# Altium schematic sheet STB_SensorBoard.SchDoc: STB Sensor Board
size A3; Author: flmoll / gruprecht; DrawnBy: flmoll; Organization: PBL; Revision: A; SheetNumber: 1; SheetTotal: 8
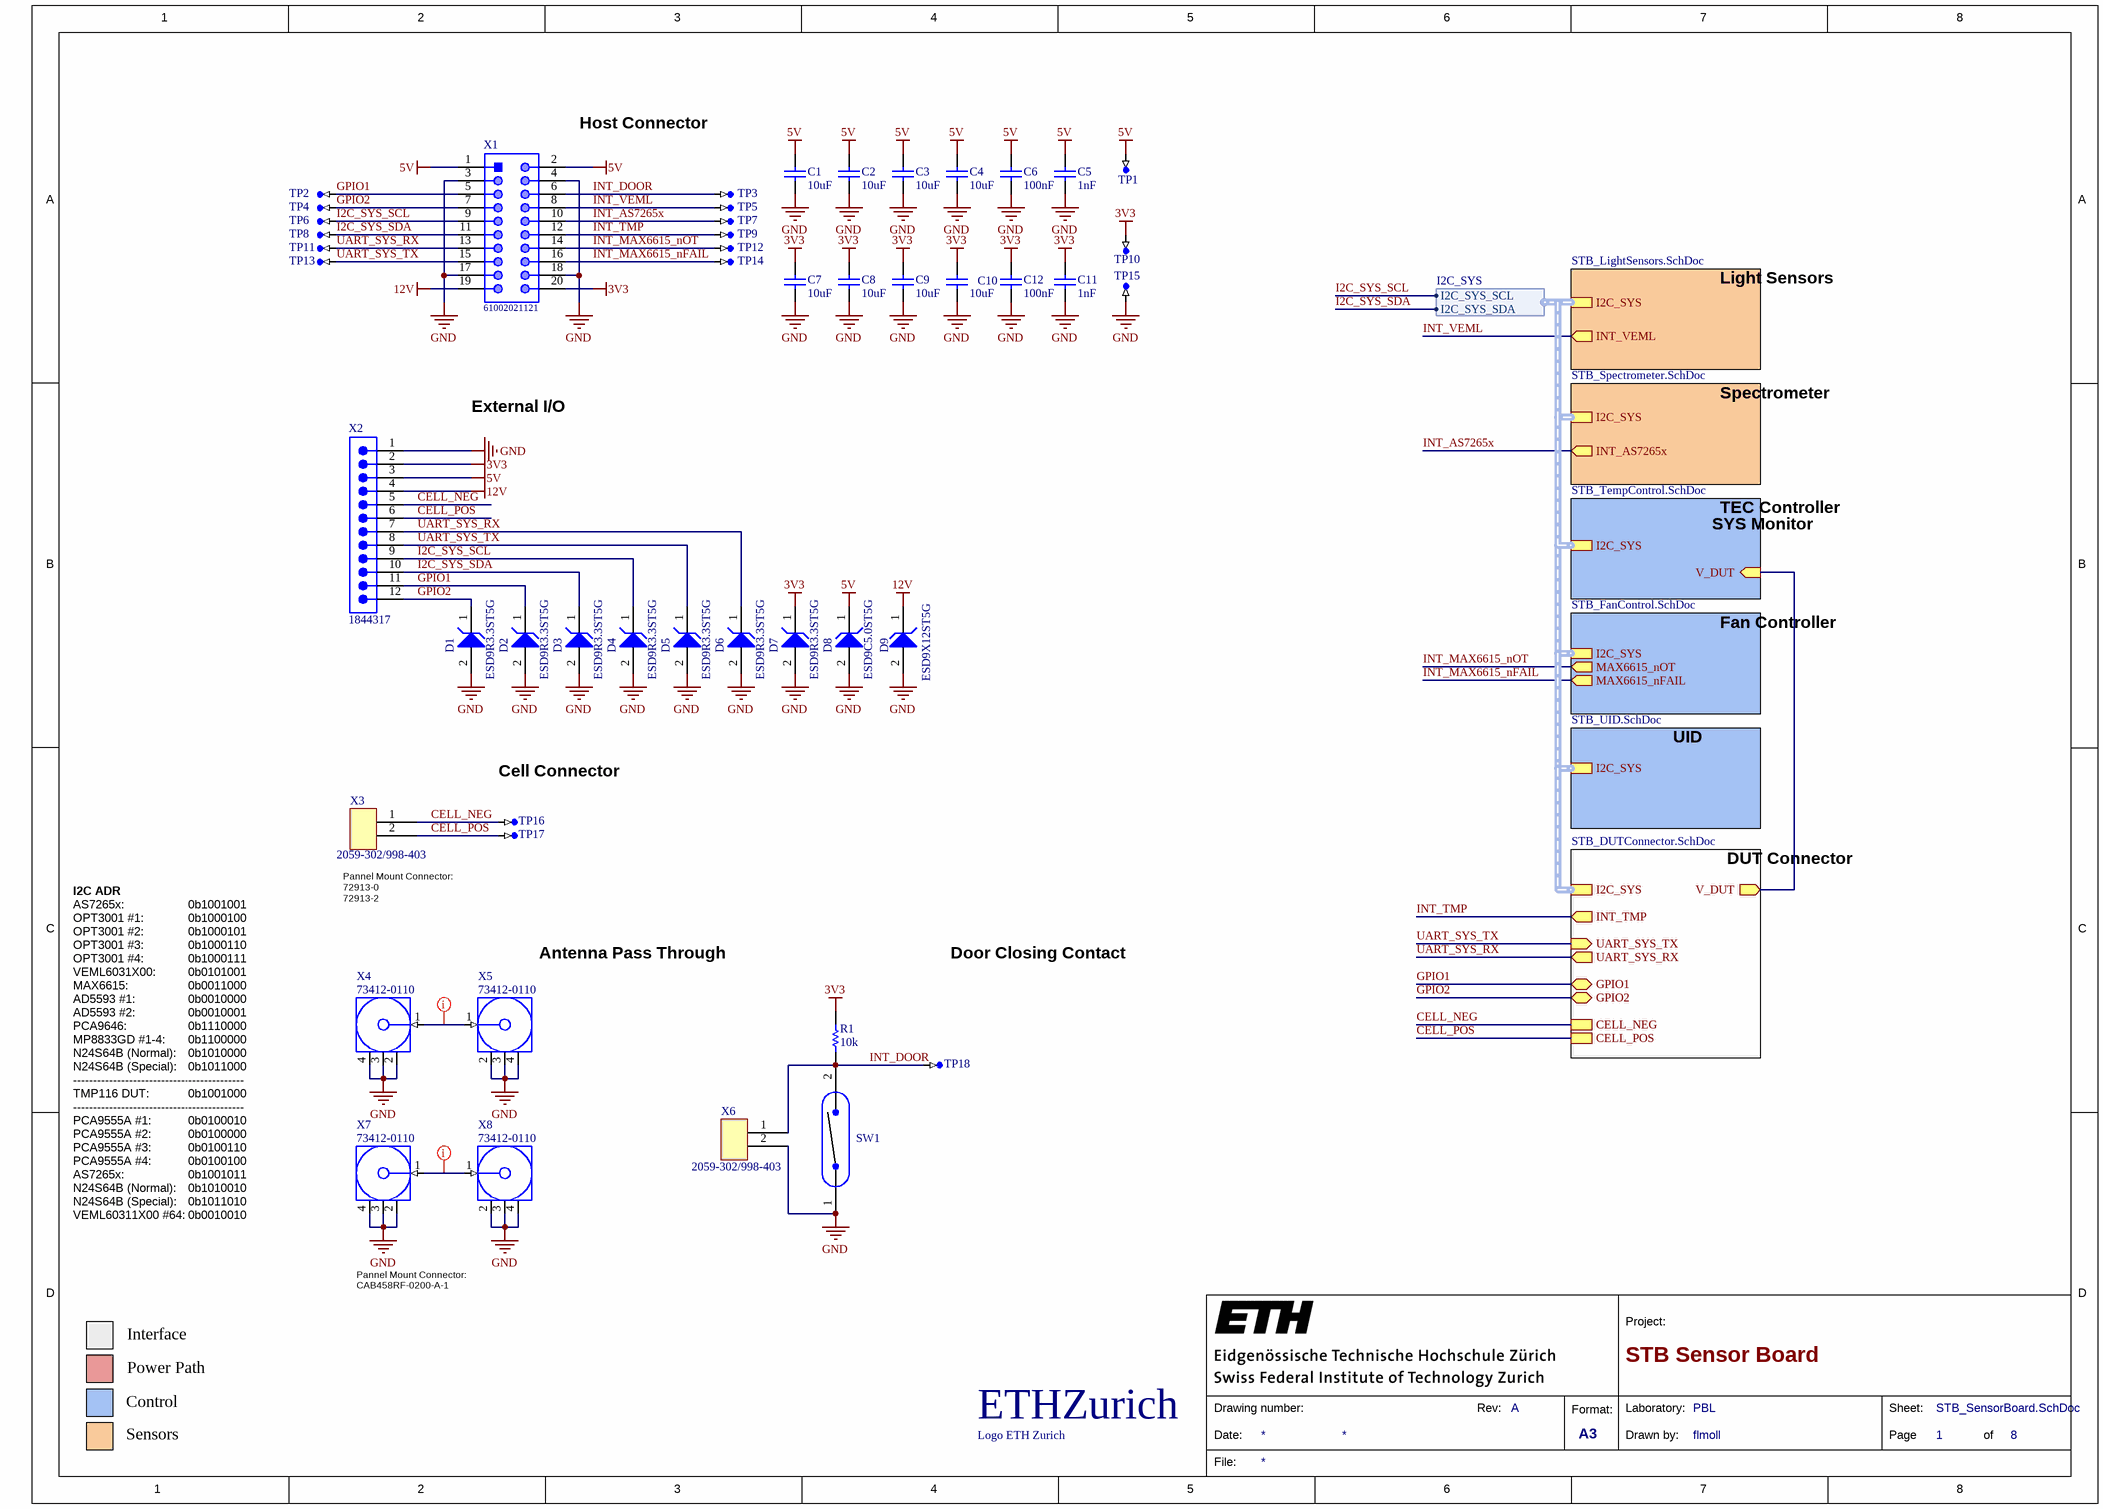
[diagram p0: STB_SensorBoard.SchDoc]

## Parts
A1  Logo ETH Zurich  [eth-zurich_5mm]  (no BOM)
C1  10uF  [CAPC0603(1608)100_L]
C2  10uF  [CAPC0603(1608)100_L]
C3  10uF  [CAPC0603(1608)100_L]
C4  10uF  [CAPC0603(1608)100_L]
C5  1nF  [CAPC1005X55X25ML5T10]
C6  100nF  [CAPC1050X55X23LL05T13]
C7  10uF  [CAPC0603(1608)100_L]
C8  10uF  [CAPC0603(1608)100_L]
C9  10uF  [CAPC0603(1608)100_L]
C10  10uF  [CAPC0603(1608)100_L]
C11  1nF  [CAPC1005X55X25ML5T10]
C12  100nF  [CAPC1050X55X23LL05T13]
D1  ESD9R3.3ST5G  [ONSC-SOD-923-2-514AB-01_V]
D2  ESD9R3.3ST5G  [ONSC-SOD-923-2-514AB-01_V]
D3  ESD9R3.3ST5G  [ONSC-SOD-923-2-514AB-01_V]
D4  ESD9R3.3ST5G  [ONSC-SOD-923-2-514AB-01_V]
D5  ESD9R3.3ST5G  [ONSC-SOD-923-2-514AB-01_V]
D6  ESD9R3.3ST5G  [ONSC-SOD-923-2-514AB-01_V]
D7  ESD9R3.3ST5G  [ONSC-SOD-923-2-514AB-01_V]
D8  ESD9C5.0ST5G  [ONSC-SOD-923-2-514AB-01_V]
D9  ESD9X12ST5G  [ONSC-SOD-923-2-514AA-01_V]
R1  10k  [RESC1005X40X25LL05T05]
SW1  MK17-B-2  [SMEL-MK17-B-2_V]  (value not drawn)
TP1  testPoint_1mm  [TP-SM-C-100]  (value not drawn)  (no BOM)
TP2  testPoint_1mm  [TP-SM-C-100]  (value not drawn)  (no BOM)
TP3  testPoint_1mm  [TP-SM-C-100]  (value not drawn)  (no BOM)
TP4  testPoint_1mm  [TP-SM-C-100]  (value not drawn)  (no BOM)
TP5  testPoint_1mm  [TP-SM-C-100]  (value not drawn)  (no BOM)
TP6  testPoint_1mm  [TP-SM-C-100]  (value not drawn)  (no BOM)
TP7  testPoint_1mm  [TP-SM-C-100]  (value not drawn)  (no BOM)
TP8  testPoint_1mm  [TP-SM-C-100]  (value not drawn)  (no BOM)
TP9  testPoint_1mm  [TP-SM-C-100]  (value not drawn)  (no BOM)
TP10  testPoint_1mm  [TP-SM-C-100]  (value not drawn)  (no BOM)
TP11  testPoint_1mm  [TP-SM-C-100]  (value not drawn)  (no BOM)
TP12  testPoint_1mm  [TP-SM-C-100]  (value not drawn)  (no BOM)
TP13  testPoint_1mm  [TP-SM-C-100]  (value not drawn)  (no BOM)
TP14  testPoint_1mm  [TP-SM-C-100]  (value not drawn)  (no BOM)
TP15  testPoint_1mm  [TP-SM-C-100]  (value not drawn)  (no BOM)
TP16  testPoint_1mm  [TP-SM-C-100]  (value not drawn)  (no BOM)
TP17  testPoint_1mm  [TP-SM-C-100]  (value not drawn)  (no BOM)
TP18  testPoint_1mm  [TP-SM-C-100]  (value not drawn)  (no BOM)
X1  61002021121  [61002021121]
X2  1844317  [1844317]
X3  2059-302/998-403  [2059-302/998-403]
X4  73412-0110  [MOLX-73412-0110_V]
X5  73412-0110  [MOLX-73412-0110_V]
X6  2059-302/998-403  [2059-302/998-403]
X7  73412-0110  [MOLX-73412-0110_V]
X8  73412-0110  [MOLX-73412-0110_V]

## Sub-sheets
DUT = STB_DUTConnector.SchDoc: I2C_SYS (harness I2C_SYS), INT_TMP (out), UART_SYS_RX (out), UART_SYS_TX (in), GPIO1 (bidir), GPIO2 (bidir), V_DUT (out), CELL_NEG, CELL_POS
FC = STB_FanControl.SchDoc: I2C_SYS (harness I2C_SYS), MAX6615_nOT (out), MAX6615_nFAIL (out)
LS = STB_LightSensors.SchDoc: I2C_SYS (harness I2C_SYS), INT_VEML (out)
SP = STB_Spectrometer.SchDoc: I2C_SYS (harness I2C_SYS), INT_AS7265x (out)
TC = STB_TempControl.SchDoc: I2C_SYS (harness I2C_SYS), V_DUT (in)
UID = STB_UID.SchDoc: I2C_SYS (harness I2C_SYS)

## Harnesses
I2C_SYS: I2C_SYS_SDA, I2C_SYS_SCL

## Nets
3V3: C7.2 C8.2 C9.2 C10.2 C11.2 C12.2 D7.1(K) R1.2 TP10.TP X1.20 X2.2
5V: C1.2 C2.2 C3.2 C4.2 C5.2 C6.2 D8.1(K) TP1.TP X1.1 X1.2 X2.3
12V: D9.1(K) X1.19 X2.4
GND: C1.1 C2.1 C3.1 C4.1 C5.1 C6.1 C7.1 C8.1 C9.1 C10.1 C11.1 C12.1 D1.2(A) D2.2(A) D3.2(A) D4.2(A) D5.2(A) D6.2(A) D7.2(A) D8.2(A) D9.2(A) SW1.1 TP15.TP X1.3 X1.4 X1.17 X1.18 X2.1 X4.2(GND) X4.3(GND) X4.4(GND) X5.2(GND) X5.3(GND) X5.4(GND) X6.2 X7.2(GND) X7.3(GND) X7.4(GND) X8.2(GND) X8.3(GND) X8.4(GND)
CELL_NEG: TP16.TP X2.5 X3.1 ; sheet DUT/CELL_NEG
CELL_POS: TP17.TP X2.6 X3.2 ; sheet DUT/CELL_POS
GPIO1: D2.1(K) TP2.TP X1.5 X2.11 ; sheet DUT/GPIO1
GPIO2: D1.1(K) TP4.TP X1.7 X2.12 ; sheet DUT/GPIO2
I2C_SYS_SCL: D4.1(K) TP6.TP X1.9 X2.9 ; sheet LS/I2C_SYS.I2C_SYS_SCL
I2C_SYS_SDA: D3.1(K) TP8.TP X1.11 X2.10 ; sheet LS/I2C_SYS.I2C_SYS_SDA
INT_AS7265x: TP7.TP X1.10 ; sheet SP/INT_AS7265x
INT_DOOR: R1.1 SW1.2 TP3.TP TP18.TP X1.6 X6.1
INT_MAX6615_nFAIL: TP14.TP X1.16 ; sheet FC/MAX6615_nFAIL
INT_MAX6615_nOT: TP12.TP X1.14 ; sheet FC/MAX6615_nOT
INT_TMP: TP9.TP X1.12 ; sheet DUT/INT_TMP
INT_VEML: TP5.TP X1.8 ; sheet LS/INT_VEML
UART_SYS_RX: D6.1(K) TP11.TP X1.13 X2.7 ; sheet DUT/UART_SYS_RX
UART_SYS_TX: D5.1(K) TP13.TP X1.15 X2.8 ; sheet DUT/UART_SYS_TX
NetX4_1: X4.1(SIGNAL) X5.1(SIGNAL)
NetX7_1: X7.1(SIGNAL) X8.1(SIGNAL)
(unnamed): sheet TC/V_DUT, sheet DUT/V_DUT

## Buses and harness runs
harness sheet DUT/I2C_SYS = sheet FC/I2C_SYS = sheet LS/I2C_SYS = sheet SP/I2C_SYS = sheet TC/I2C_SYS = sheet UID/I2C_SYS

## Layout directives
net class S50R: NetX4_1, NetX7_1

## Notes on the sheet
- (near X1) Host Connector
- Light Sensors
- (near X2) External I/O
- Spectrometer
- TEC Controller
- SYS Monitor
- Fan Controller
- Cell Connector
- UID
- I2C ADR
- (near X3) Pannel Mount Connector:
  72913-0
  72913-2
- DUT Connector
- Antenna Pass Through
- Door Closing Contact
- AS7265x:
  OPT3001 #1:
  OPT3001 #2:
  OPT3001 #3:
  OPT3001 #4:
  VEML6031X00:
  MAX6615:
  AD5593 #1:
  AD5593 #2:
  PCA9646:
  MP8833GD #1-4:
  N24S64B (Normal):
  N24S64B (Special):
  -----------------------------
  TMP116 DUT:
  -----------------------------
  PCA9555A #1:
  PCA9555A #2:
  PCA9555A #3:
  PCA9555A #4:
  AS7265x:
  N24S64B (Normal):
  N24S64B (Special):
  VEML60311X00 #64:
  TMP116 #64:
  TMP116 DUT:
- 0b1001001
  0b1000100
  0b1000101
  0b1000110
  0b1000111
  0b0101001
  0b0011000
  0b0010000
  0b0010001
  0b1110000
  0b1100000
  0b1010000
  0b1011000
  --------------
  0b1001000
  --------------
  0b0100010
  0b0100000
  0b0100110
  0b0100100
  0b1001011
  0b1010010
  0b1011010
  0b0010010
  0b1001010
  0b1001000
- Pannel Mount Connector:
  CAB458RF-0200-A-1
- Interface
- Power Path
- Control
- Sensors
- 1
- 2
- 3
- 4
- 5
- 6
- 7
- 8
- A
- B
- C
- D
- Project:
- Date:
- Drawing number:
- Rev:
- Format:
- A3
- Drawn by:
- Laboratory:
- Page
- Sheet:
- of
- File:
- (in symbol CMP-00038-1) ETHZurich

## Library data of the parts
A1 = CMP-00038-1
C1-C4 C7-C10 = CMP-1035-02799-1: CAP 10uF 10V ±10% 0603 (1608 Metric) Thickness 1mm SMD; Manufacturer: Samsung; Manufacturer Part Number: CL10A106MP8NNNC; Tolerance: Â±10%; Case-Metric: 1608; Case-EIA: 0603; Dielectric: X5R; Max Thickness: 1 mm; Technology: SMT; Rated Voltage: 10 V; Value: 10uF; Supplier 1: Digi-Key; Supplier Part Number 1: 1276-1871-1-ND; RoHS: Yes; Category: Ceramic Capacitors; Stock 1: 643992; Pricing 1: 1=0.26000, 10=0.17600, 50=0.10580, 100=0.08930, 500=0.06112, 1000=0.05407 (USD); Mount: Surface Mount; Case/Package: 0603; Case Code (Imperial): 0603; Case Code (Metric): 1608; Contact Plating: Tin; Min Operating Temperature: -55°C; Max Operating Temperature: 85°C; Packaging: Tape and Reel; Capacitance: 10uF; Voltage Rating: 10V; Voltage Rating (DC): 10V; Package Quantity: 1; Length: 1.6mm; Width: 0.031inch; Height: 0.8mm; Thickness: 0.035inch; Depth: 0.8mm; Radiation Hardening: No; Lead Free: Lead Free; ComponentLink1URL: https://datasheet.ciiva.com/25793/cl10a106mp8nnnc-25793222.pdf?src-supplier=Digi-Key; ComponentLink1Description: https://datasheet.ciiva.com/25793/cl10a106mp8nnnc-25793222.pdf?src-supplier=Digi-Key; ComponentLink2URL: https://datasheet.ciiva.com/16200/cl10a106mp8nnnc-16200411.pdf?src-supplier=Future+Electronics; ComponentLink2Description: https://datasheet.ciiva.com/16200/cl10a106mp8nnnc-16200411.pdf?src-supplier=Future+Electronics; ComponentLink3URL: https://datasheet.ciiva.com/26946/getdatasheetpartid-357531-26946980.pdf?src-supplier=Verical; ComponentLink3Description: https://datasheet.ciiva.com/26946/getdatasheetpartid-357531-26946980.pdf?src-supplier=Verical
C5 C11 = CMP-1662-00017-1: Chip Capacitor, 1 nF, +/- 10%, 50 V, -55 to 125 degC, 0402 (1005 Metric), RoHS, Tape and Reel; Manufacturer: Murata; Manufacturer Part Number: GRM155R71H102KA01D; Case\/Package: 0402; Type (Capacitors): X7R; Voltage Rating (DC): 50 V; Dielectric Material: Ceramic; Multilayer: Yes; Rated DC Voltage (URdc): 50V; Width: 0.5 mm; Pins: 2; REACH SVHC: No SVHC; Length: 1 mm; Height: 0.5 mm; PackageDescription: 2-Pin Surface Mount Device, Body 1 x 0.5 mm; DatasheetVersion: 07/2016; Mount: Surface Mount; ComponentLink2Description: Datasheet; Tolerance: 10%; ComponentLink2URL: http://psearch.en.murata.com/capacitor/product/GRM155R71H102KA01%23.pdf; ComponentLink1URL: http://www.murata.com/; Case Code (Metric): 1005; Package Quantity: 10000; Min Operating Temperature: -55 degC; Max Operating Temperature: 125 degC; Value: 1 nF; Voltage Rating: 50 V; ComponentLink1Description: Manufacturer URL; Packaging: Tape and Reel; Radiation Hardening: No; RoHSCompliant: true; PackageReference: 0402; Mounting Technology: Surface Mount; Case Code (Imperial): 0402; Supplier 1: Digi-Key; Supplier Part Number 1: 490-1303-6-ND; RoHS: Yes; Category: Ceramic Capacitors; Stock 1: 8959614; Pricing 1: 1=0.10000, 10=0.01800, 50=0.01000, 100=0.00810, 500=0.00578, 1000=0.00454, 2500=0.00412, 5000=0.00380 (USD); Number of Pins: 2; Package Shape: Rectangular; Size Code: 0402; Terminal Finish: Nickel; Capacitor Type: Ceramic; Negative Tolerance: 10%; Positive Tolerance: 10%; Temperature Characteristics Code: X7R; Termination: Wraparound; JESD-609 Code: e3; Package Style: SMTMeter; Reach SVHC Compliant: Yes; RoHS Compliant: Yes; ComponentLink3URL: https://datasheet.ciiva.com:443/pdfs/VipMasterIC/IC/MURE/MURE-S-A0008911154/MURE-S-A0008911121-1.pdf?src-supplier=IHS+Markit; ComponentLink3Description: https://datasheet.ciiva.com:443/pdfs/VipMasterIC/IC/MURE/MURE-S-A0008911154/MURE-S-A0008911121-1.pdf?src-supplier=IHS+Markit; ComponentLink4URL: https://datasheet.ciiva.com/6072/1784401-6072451.pdf?src-supplier=Farnell; ComponentLink4Description: https://datasheet.ciiva.com/6072/1784401-6072451.pdf?src-supplier=Farnell; ComponentLink5URL: https://datasheet.ciiva.com/129/partnumbering-e-01-129755.pdf?src-supplier=Digi-Key; ComponentLink5Description: https://datasheet.ciiva.com/129/partnumbering-e-01-129755.pdf?src-supplier=Digi-Key; ComponentLink6URL: https://datasheet.ciiva.com/18101/getdatasheetpartid-37826-18101056.pdf?src-supplier=Verical; ComponentLink6Description: https://datasheet.ciiva.com/18101/getdatasheetpartid-37826-18101056.pdf?src-supplier=Verical; ComponentLink7URL: https://datasheet.ciiva.com/29199/454211-da-01-en-vs-kondensator-0402-29199736.pdf?src-supplier=Conrad; ComponentLink7Description: https://datasheet.ciiva.com/29199/454211-da-01-en-vs-kondensator-0402-29199736.pdf?src-supplier=Conrad; ComponentLink8URL: https://datasheet.ciiva.com/14116/grmseries-highdielectrictype-eng-14116845.pdf?src-supplier=Distrelec; ComponentLink8Description: https://datasheet.ciiva.com/14116/grmseries-highdielectrictype-eng-14116845.pdf?src-supplier=Distrelec; ComponentLink9URL: https://datasheet.ciiva.com/14116/grmseries-highdielectrictype-eng-14116906.pdf?src-supplier=Distrelec; ComponentLink9Description: https://datasheet.ciiva.com/14116/grmseries-highdielectrictype-eng-14116906.pdf?src-supplier=Distrelec; ComponentLink10URL: https://datasheet.ciiva.com/28659/608985-28659452.pdf?src-supplier=Element14; ComponentLink10Description: https://datasheet.ciiva.com/28659/608985-28659452.pdf?src-supplier=Element14; ComponentLink11URL: https://datasheet.ciiva.com/129/partnumbering-e-01-129754.pdf?src-supplier=Digi-Key; ComponentLink11Description: https://datasheet.ciiva.com/129/partnumbering-e-01-129754.pdf?src-supplier=Digi-Key; ComponentLink12URL: https://datasheet.ciiva.com/129/partnumbering-e-01-129753.pdf?src-supplier=Digi-Key; ComponentLink12Description: https://datasheet.ciiva.com/129/partnumbering-e-01-129753.pdf?src-supplier=Digi-Key; ComponentLink13URL: https://datasheet.ciiva.com/24217/c02e-24217773.pdf?src-supplier=Mouser; ComponentLink13Description: https://datasheet.ciiva.com/24217/c02e-24217773.pdf?src-supplier=Mouser
C6 C12 = CMP-2000-05439-1: Chip Capacitor, 100 nF, +/- 10%, 16 V, -55 to 125 degC, 0402 (1005 Metric), RoHS, Tape and Reel; Manufacturer: Samsung Electro-Mechanics; Manufacturer Part Number: CL05B104KO5NNNC; Dielectric: X7R; Rated Voltage: 16V; Dielectric Material: Ceramic; Multilayer: Yes; Case Size/Dimension: 0402; Tolerance (%): ±10%; Value: 100nF; Manufacturer URL: http://www.samsungsem.com/global/index.jsp; Datasheet URL: https://datasheet.ciiva.com/29198/458718-da-01-en-vs-kondensator-0402-29198423.pdf; Datasheet Version: Nov-10; Supplier 1: Digi-Key; Supplier Part Number 1: 1276-1001-6-ND; RoHS: Yes; Category: Ceramic Capacitors; Stock 1: 24854634; Pricing 1: 1=0.10000, 10=0.02400, 50=0.01300, 100=0.01050, 500=0.00752, 1000=0.00592, 2500=0.00538, 5000=0.00495 (USD); Mount: Surface Mount; Number of Pins: 2; Package Shape: Rectangular; Size Code: 0402; Terminal Finish: Nickel; Min Operating Temperature: -55°C; Max Operating Temperature: 125°C; JESD-609 Code: e3; Capacitor Type: Ceramic; Negative Tolerance: 10%; Packaging: Tape and Reel; Positive Tolerance: 10%; Rated DC Voltage (URdc): 16V; Temperature Characteristics Code: X7R; Termination: Wraparound; Package Style: SMTMeter; Length: 1mm; Width: 0.5mm; Height: 0.55mm; REACH SVHC: Yes; RoHS Compliant: Yes; ComponentLink1URL: https://datasheet.ciiva.com:443/pdfs/VipMasterIC/IC/SEMS/SEMS-S-A0008384515/SEMS-S-A0008872921-1.pdf?src-supplier=IHS+Markit; ComponentLink1Description: https://datasheet.ciiva.com:443/pdfs/VipMasterIC/IC/SEMS/SEMS-S-A0008384515/SEMS-S-A0008872921-1.pdf?src-supplier=IHS+Markit; ComponentLink2URL: https://datasheet.ciiva.com/26920/getdatasheetpartid-359683-26920169.pdf?src-supplier=Verical; ComponentLink2Description: https://datasheet.ciiva.com/26920/getdatasheetpartid-359683-26920169.pdf?src-supplier=Verical; ComponentLink3URL: https://datasheet.ciiva.com/29198/458718-da-01-en-vs-kondensator-0402-29198423.pdf?src-supplier=Conrad; ComponentLink3Description: https://datasheet.ciiva.com/29198/458718-da-01-en-vs-kondensator-0402-29198423.pdf?src-supplier=Conrad; ComponentLink4URL: https://datasheet.ciiva.com/26309/mlcc-catalogdownload2013-eng-26309003.pdf?src-supplier=Distrelec; ComponentLink4Description: https://datasheet.ciiva.com/26309/mlcc-catalogdownload2013-eng-26309003.pdf?src-supplier=Distrelec; ComponentLink5URL: https://datasheet.ciiva.com/16208/cl05b104kq5nnnc-16208343.pdf?src-supplier=Future+Electronics; ComponentLink5Description: https://datasheet.ciiva.com/16208/cl05b104kq5nnnc-16208343.pdf?src-supplier=Future+Electronics
D1-D7 = CMP-1063-00117-1: Transient Voltage Suppressor, ESD Protection Diode with Ultra-Low Leakage, 2-Pin SOD-923, Pb-Free, Tape and Reel; Manufacturer: On Semiconductor; Manufacturer Part Number: SZESD9R3.3ST5G; C Max (pF): 0.9; V(BR) Min (V): 4.8; Number of Lines: 1; Direction: Unidirectional; IR Max (uA): 0.001; VRWM Max (V): 3.3; Clamping Voltage-Max: 7.8V; Diode Type: TRANS VOLTAGE SUPPRESSOR; Rep Pk Reverse Voltage-Max: 3.3V; Breakdown Voltage-Nom: 4.8V; PackageReference: SOD-923-2-514AB-01; ComponentLink3URL: http://www.onsemi.com/pub_link/Collateral/514AB.PDF; DatasheetVersion: Rev. 1; PackageDescription: 2-Pin SOD, Body 0.8 x 0.6 mm; ComponentLink1URL: http://www.onsemi.com/; ComponentLink2Description: Datasheet; ComponentLink3Description: Package Specification; Packing: Tape and Reel; ComponentLink1Description: Manufacturer URL; ComponentLink2URL: http://www.onsemi.com/pub_link/Collateral/ESD9R3.3S-D.PDF; RoHS: Pb-Free; PackageVersion: Rev. C, 03/2011; Mounting Technology: Surface Mount; PartNumber: ESD9R3.3ST5G; Supplier 1: Digi-Key; Supplier Part Number 1: SZESD9R3.3ST5GOSDKR-ND; Category: ESD and Circuit Protection ICs; Stock 1: 31698; Pricing 1: 1=0.61000, 10=0.52500, 100=0.39180, 500=0.30782, 1000=0.23786, 2000=0.21688 (USD); Terminal Finish: Tin; JESD-609 Code: e3; Polarity: Unidirectional; Moisture Sensitivity Level: 1; Surface Mount: Yes; REACH SVHC: Yes; RoHS Compliant: Yes; ComponentLink4URL: https://datasheet.ciiva.com:443/pdfs/VipMasterIC/IC/ONSM/ONSM-S-A0003514262/ONSM-S-A0003583458-1.pdf?src-supplier=IHS+Markit; ComponentLink4Description: https://datasheet.ciiva.com:443/pdfs/VipMasterIC/IC/ONSM/ONSM-S-A0003514262/ONSM-S-A0003583458-1.pdf?src-supplier=IHS+Markit; ComponentLink5URL: https://datasheet.ciiva.com/24087/esd9r3-3s-d-241663-24087547.pdf?src-supplier=Mouser; ComponentLink5Description: https://datasheet.ciiva.com/24087/esd9r3-3s-d-241663-24087547.pdf?src-supplier=Mouser
D8 = CMP-1063-00110-1: Transient Voltage Suppressor, Micro-Packaged Diode for ESD Protection, 2-Pin SOD-923, Pb-Free, Tape and Reel; Manufacturer: On Semiconductor; C Max (pF): 6.2; Number of Lines: 1; Direction: Unidirectional; IR Max (uA): 0.5; V(BR) Min (V): 11; VRWM Max (V): 5; Diode Element Material: SILICON; Package Body Material: Plastic; Min Breakdown Voltage: 11V; Diode Type: TRANS VOLTAGE SUPPRESSOR; Rep Pk Reverse Voltage-Max: 5V; Time @ Peak Reflow Temperature-Max (s): 40s; Max Power Dissipation: 150mW; Reference Standard: AEC-Q101; Qualification Status: Not Qualified; DatasheetVersion: Rev. 3; Mounting Technology: Surface Mount; PackageReference: SOD-923-2-514AB-01; ComponentLink2Description: Datasheet; PackageVersion: Rev. C, 03/2011; ComponentLink2URL: http://www.onsemi.cn/pub_link/Collateral/ESD9C3.3S-D.PDF; ComponentLink3Description: Package Specification; PartNumber: ESD9C5.0ST5G; ComponentLink1Description: Manufacturer URL; ComponentLink1URL: http://www.onsemi.com/; PackageDescription: 2-Pin SOD, Body 0.8 x 0.6 mm; ComponentLink3URL: http://www.onsemi.com/pub_link/Collateral/514AB.PDF; Packing: Tape and Reel; RoHS: Pb-Free; Supplier 1: Digi-Key; Supplier Part Number 1: ESD9C5.0ST5GOSDKR-ND; Manufacturer Part Number: ESD9C5.0ST5G; Category: ESD and Circuit Protection ICs; Stock 1: 345553; Pricing 1: 1=0.38000, 10=0.30900, 100=0.16370, 500=0.10772, 1000=0.07325, 2000=0.06607 (USD); Number of Pins: 2; Package Shape: Rectangular; Terminal Finish: Tin; Min Operating Temperature: -55°C; Max Operating Temperature: 150°C; JESD-609 Code: e3; Polarity: Unidirectional; JESD-30 Code: R-PDSO-F2; Moisture Sensitivity Level: 1; Number of Elements: 1; Package Style: SMALL OUTLINEMeter; Surface Mount: Yes; Technology: AVALANCHE; Terminal Form: Flat; Terminal Position: DUAL; Peak Reflow Temperature (Cel): 260°C; REACH SVHC: Yes; RoHS Compliant: Yes; ComponentLink4URL: https://datasheet.ciiva.com:443/pdfs/VipMasterIC/IC/ONSM/ONSM-S-A0003514262/ONSM-S-A0003579756-1.pdf?src-supplier=IHS+Markit; ComponentLink4Description: https://datasheet.ciiva.com:443/pdfs/VipMasterIC/IC/ONSM/ONSM-S-A0003514262/ONSM-S-A0003579756-1.pdf?src-supplier=IHS+Markit; ComponentLink5URL: https://datasheet.ciiva.com/1219/1748974-1219321.pdf?src-supplier=Newark; ComponentLink5Description: https://datasheet.ciiva.com/1219/1748974-1219321.pdf?src-supplier=Newark; ComponentLink6URL: https://datasheet.ciiva.com/4509/esd9c3-3s-d-241629-4509822.pdf?src-supplier=Mouser; ComponentLink6Description: https://datasheet.ciiva.com/4509/esd9c3-3s-d-241629-4509822.pdf?src-supplier=Mouser; ComponentLink7URL: https://datasheet.ciiva.com/15143/getdatasheetpartid-53763-15143125.pdf?src-supplier=Verical; ComponentLink7Description: https://datasheet.ciiva.com/15143/getdatasheetpartid-53763-15143125.pdf?src-supplier=Verical; ComponentLink8URL: https://datasheet.ciiva.com/339/esd9c3-3s-d-339778.pdf?src-supplier=Digi-Key; ComponentLink8Description: https://datasheet.ciiva.com/339/esd9c3-3s-d-339778.pdf?src-supplier=Digi-Key; ComponentLink9URL: https://datasheet.ciiva.com/11195/esd9c3-3s-d-11195341.pdf?src-supplier=Avnet; ComponentLink9Description: https://datasheet.ciiva.com/11195/esd9c3-3s-d-11195341.pdf?src-supplier=Avnet; ComponentLink10URL: https://datasheet.ciiva.com/339/esd9c3-3s-d-339779.pdf?src-supplier=Digi-Key; ComponentLink10Description: https://datasheet.ciiva.com/339/esd9c3-3s-d-339779.pdf?src-supplier=Digi-Key; ComponentLink11URL: https://datasheet.ciiva.com/339/esd9c3-3s-d-339780.pdf?src-supplier=Digi-Key; ComponentLink11Description: https://datasheet.ciiva.com/339/esd9c3-3s-d-339780.pdf?src-supplier=Digi-Key
D9 = CMP-1063-00105-1: Transient Voltage Suppressor, Micro-Packaged Diode for ESD Protection, 2-Pin SOD-923, Pb-Free, Tape and Reel; Manufacturer: On Semiconductor; IR Max (uA): 1; Direction: Unidirectional; VRWM Max (V): 12; PPK Max (W): 140; V(BR) Min (V): 13.5; Diode Element Material: SILICON; Package Body Material: Plastic; Min Breakdown Voltage: 13.5V; Clamping Voltage-Max: 23.7V; Diode Type: TRANS VOLTAGE SUPPRESSOR; Max Power Dissipation: 150mW; Rep Pk Reverse Voltage-Max: 12V; Non-rep Peak Rev Power Dis-Max: 140W; Time @ Peak Reflow Temperature-Max (s): 40s; Qualification Status: Not Qualified; Mounting Technology: Surface Mount; ComponentLink3URL: http://www.onsemi.com/pub_link/Collateral/514AA.PDF; PackageVersion: Rev. E, 03/2011; Packing: Tape and Reel; PartNumber: ESD9X12ST5G; PackageDescription: 2-Pin SOD, Body 0.8 x 0.6 mm; ComponentLink3Description: Package Specification; DatasheetVersion: Rev. 7; RoHS: Pb-Free; ComponentLink2Description: Datasheet; Number of Lines: 1; PackageReference: SOD-923-2-514AA-01; ComponentLink2URL: http://www.onsemi.com/pub_link/Collateral/ESD9X3.3ST5G-D.PDF; ComponentLink1URL: http://www.onsemi.com/; ComponentLink1Description: Manufacturer URL; Supplier 1: Digi-Key; Supplier 2: Digi-Key; Supplier Part Number 2: ESD9X12ST5GOSDKR-ND; Manufacturer Part Number: ESD9X12ST5G; Category: ESD and Circuit Protection ICs; Stock 2: 71759; Pricing 2: 1=0.30000, 10=0.24400, 100=0.12930, 500=0.08506, 1000=0.05784, 2000=0.05218 (USD); Number of Pins: 2; Package Shape: Rectangular; Terminal Finish: Tin; Min Operating Temperature: -55°C; Max Operating Temperature: 150°C; JESD-609 Code: e3; Polarity: Unidirectional; JESD-30 Code: R-PDSO-F2; Moisture Sensitivity Level: 1; Number of Elements: 1; Package Style: SMALL OUTLINEMeter; Surface Mount: Yes; Technology: AVALANCHE; Terminal Form: Flat; Terminal Position: DUAL; Peak Reflow Temperature (Cel): 260°C; REACH SVHC: Yes; RoHS Compliant: Yes; ComponentLink4URL: https://datasheet.ciiva.com:443/pdfs/VipMasterIC/IC/ONSM/ONSM-S-A0003579749/ONSM-S-A0003579749-1.pdf?src-supplier=IHS+Markit; ComponentLink4Description: https://datasheet.ciiva.com:443/pdfs/VipMasterIC/IC/ONSM/ONSM-S-A0003579749/ONSM-S-A0003579749-1.pdf?src-supplier=IHS+Markit; ComponentLink5URL: https://datasheet.ciiva.com/6577/esd9x3-3st5g-d-6577990.pdf?src-supplier=Digi-Key; ComponentLink5Description: https://datasheet.ciiva.com/6577/esd9x3-3st5g-d-6577990.pdf?src-supplier=Digi-Key; ComponentLink6URL: https://datasheet.ciiva.com/16393/esd9x3-3st5g-d-16393983.pdf?src-supplier=Future+Electronics; ComponentLink6Description: https://datasheet.ciiva.com/16393/esd9x3-3st5g-d-16393983.pdf?src-supplier=Future+Electronics; ComponentLink7URL: https://datasheet.ciiva.com/353/esd9x3-3st5g-d-353784.pdf?src-supplier=Digi-Key; ComponentLink7Description: https://datasheet.ciiva.com/353/esd9x3-3st5g-d-353784.pdf?src-supplier=Digi-Key; ComponentLink8URL: https://datasheet.ciiva.com/353/esd9x3-3st5g-d-353785.pdf?src-supplier=Digi-Key; ComponentLink8Description: https://datasheet.ciiva.com/353/esd9x3-3st5g-d-353785.pdf?src-supplier=Digi-Key
R1 = CMP-2000-07588-1: Chip Resistor, 10 KOhm, +/- 1%, 0.1 W, -55 to 155 degC, 0402 (1005 Metric), RoHS, Tape and Reel; Manufacturer: Panasonic; Manufacturer Part Number: ERJ-2RKF1002X; Power Rating: 100mW; Voltage Rating: 50V; Value: 10 kOhm; Case\/Package: 0402; Temperature Coefficient: 100ppm\/degreesC; Rated Temperature: 70°C; Package Height: 0.35mm; Package Length: 1mm; Package Width: 0.5mm; Reference Standard: AEC-Q200; RoHSCompliant: True; Lead Free: LeadFree; Package Quantity: 1; Contact Plating: Tin; Length: 1mm; Radiation Hardening: No; REACH SVHC: NoSVHC; Max Operating Temperature: 155degC; Depth: 0.5mm; Case Code (Imperial): 0402; Military Standard: Not; Package Description: 2-Pin Surface Mount Device, Body 1 x 0.5 mm; Termination: SMD/SMT; Case Code (Metric): 1005; Height: 0.35mm; Packaging: TapeandReel; Voltage Rating (DC): 50V; Package Reference: 402; Number of Pins: 2; Tolerance: 1%; Mounting Technology: SurfaceMount; Width: 0.02inch; Mount: SurfaceMount; Datasheet URL: https://industrial.panasonic.com/cdbs/www-data/pdf/RDA0000/AOA0000C304.pdf; Composition: ThickFilm; Datasheet Version: 02/2017; Manufacturer URL: http://www.panasonic.com/; Max Power Dissipation: 100mW; Number of Terminations: 2; Min Operating Temperature: -55degC; Supplier 1: Digi-Key; Supplier Part Number 1: P10.0KLDKR-ND; RoHS: Yes; Category: Chip SMD Resistors; Stock 1: 108; Pricing 1: 1=0.10000, 10=0.03300, 100=0.01330, 1000=0.00599, 2500=0.00520, 5000=0.00429 (USD); Size Code: 0402; Terminal Finish: Nickel; Package Shape: Rectangular; Resistor Type: FIXED RESISTOR; Rated Power Dissipation (P): 100mW; Technology: METAL GLAZE/THICK FILM; Working Voltage: 50V; Construction: Rectangular; Package Style: SMTMeter; JESD-609 Code: e3; RoHS Compliant: Yes; ComponentLink1URL: https://datasheet.ciiva.com:443/pdfs/VipMasterIC/IC/PANA/PANA-S-A0009889626/PANA-S-A0009889626-1.pdf?src-supplier=IHS+Markit; ComponentLink1Description: https://datasheet.ciiva.com:443/pdfs/VipMasterIC/IC/PANA/PANA-S-A0009889626/PANA-S-A0009889626-1.pdf?src-supplier=IHS+Markit; ComponentLink2URL: https://datasheet.ciiva.com/11821/0900766b80f80784-11821171.pdf?src-supplier=RSComponents; ComponentLink2Description: https://datasheet.ciiva.com/11821/0900766b80f80784-11821171.pdf?src-supplier=RSComponents; ComponentLink3URL: https://datasheet.ciiva.com/27055/1987020-27055643.pdf?src-supplier=Jameco; ComponentLink3Description: https://datasheet.ciiva.com/27055/1987020-27055643.pdf?src-supplier=Jameco; ComponentLink4URL: https://datasheet.ciiva.com/43467/1678782-43467402.pdf?src-supplier=Farnell; ComponentLink4Description: https://datasheet.ciiva.com/43467/1678782-43467402.pdf?src-supplier=Farnell; ComponentLink5URL: https://datasheet.ciiva.com/28514/1678782-28514185.pdf?src-supplier=Element14; ComponentLink5Description: https://datasheet.ciiva.com/28514/1678782-28514185.pdf?src-supplier=Element14; ComponentLink6URL: https://datasheet.ciiva.com/24023/aoa0000ce2-24023017.pdf?src-supplier=Mouser; ComponentLink6Description: https://datasheet.ciiva.com/24023/aoa0000ce2-24023017.pdf?src-supplier=Mouser; ComponentLink7URL: https://datasheet.ciiva.com/16782/70260748-16782590.pdf?src-supplier=Allied+Electronics; ComponentLink7Description: https://datasheet.ciiva.com/16782/70260748-16782590.pdf?src-supplier=Allied+Electronics; ComponentLink8URL: https://datasheet.ciiva.com/16786/70260748-16786734.pdf?src-supplier=Allied+Electronics; ComponentLink8Description: https://datasheet.ciiva.com/16786/70260748-16786734.pdf?src-supplier=Allied+Electronics; ComponentLink9URL: https://datasheet.ciiva.com/9194/aoa0000ce2-9194142.pdf?src-supplier=Avnet; ComponentLink9Description: https://datasheet.ciiva.com/9194/aoa0000ce2-9194142.pdf?src-supplier=Avnet; ComponentLink10URL: https://datasheet.ciiva.com/16199/aoa0000ce2-16199478.pdf?src-supplier=Future+Electronics; ComponentLink10Description: https://datasheet.ciiva.com/16199/aoa0000ce2-16199478.pdf?src-supplier=Future+Electronics; ComponentLink11URL: https://datasheet.ciiva.com/48531/aoa0000ce2-48531069.pdf?src-supplier=Avnet; ComponentLink11Description: https://datasheet.ciiva.com/48531/aoa0000ce2-48531069.pdf?src-supplier=Avnet; ComponentLink12URL: https://datasheet.ciiva.com/30201/aoa0000ce2-30201022.pdf?src-supplier=Onlinecomponents.com; ComponentLink12Description: https://datasheet.ciiva.com/30201/aoa0000ce2-30201022.pdf?src-supplier=Onlinecomponents.com
SW1 = CMP-2000-06713-1: Molded Body Reed Switch, 100 V, 10 W, -40 to 130 degC, 2-Pin SMD, RoHS, Tape and Reel; Manufacturer: Standex Meder; Package Shape/Style: Rectangular; Sensors/Transducers Type: PROXIMITY SENSOR,PHOTOELECTRIC; Response Time: 100us; Body Length or Diameter: 8.5mm; Body Breadth: 2.1inch; Body Height: 2.1mm; Datasheet Version: Rev. 17, 12/2014; Datasheet URL: http://www.masterelectronics.com/productFiles/mf-MDR/9171800022e.pdf; Manufacturer URL: https://standexelectronics.com; Package Reference: MK17-B-2; Mounting Technology: SurfaceMount; Package Description: 2-Pin Surface Mount Device, Body 8.5 x 2.1 mm; Supplier 1: Digi-Key; Supplier Part Number 1: 374-1021-2-ND; Manufacturer Part Number: MK17-B-2; RoHS: Yes; Category: Signal Relays; Stock 1: 6000; Pricing 1: 2000=1.64933, 4000=1.49834, 6000=1.43750 (USD); Mount: Surface Mount; Housing Material: Resin; Min Operating Temperature: -40°C; Max Operating Temperature: 130°C; Termination: Solder; REACH SVHC: No SVHC; RoHS Compliant: Yes; ComponentLink1URL: https://datasheet.ciiva.com:443/pdfs/VipMasterIC/IC/STME/STME-S-A0010126788/STME-S-A0010126848-1.pdf?src-supplier=IHS+Markit; ComponentLink1Description: https://datasheet.ciiva.com:443/pdfs/VipMasterIC/IC/STME/STME-S-A0010126788/STME-S-A0010126848-1.pdf?src-supplier=IHS+Markit; ComponentLink2URL: https://datasheet.ciiva.com/2818/9171800022e-2818053.pdf?src-supplier=Digi-Key; ComponentLink2Description: https://datasheet.ciiva.com/2818/9171800022e-2818053.pdf?src-supplier=Digi-Key; ComponentLink3URL: https://datasheet.ciiva.com/4626/9171800022e-11078-4626565.pdf?src-supplier=Mouser; ComponentLink3Description: https://datasheet.ciiva.com/4626/9171800022e-11078-4626565.pdf?src-supplier=Mouser; ComponentLink4URL: https://datasheet.ciiva.com/1320/96345-1320425.pdf?src-supplier=Element14; ComponentLink4Description: https://datasheet.ciiva.com/1320/96345-1320425.pdf?src-supplier=Element14; ComponentLink5URL: https://datasheet.ciiva.com/15099/getdatasheetpartid-639745-15099041.pdf?src-supplier=Verical; ComponentLink5Description: https://datasheet.ciiva.com/15099/getdatasheetpartid-639745-15099041.pdf?src-supplier=Verical; ComponentLink6URL: https://datasheet.ciiva.com/30182/9171800022e-30182855.pdf?src-supplier=Onlinecomponents.com; ComponentLink6Description: https://datasheet.ciiva.com/30182/9171800022e-30182855.pdf?src-supplier=Onlinecomponents.com; ComponentLink7URL: https://datasheet.ciiva.com/15697/23-en-1-sensormk17e-15697662.pdf?src-supplier=Onlinecomponents.com; ComponentLink7Description: https://datasheet.ciiva.com/15697/23-en-1-sensormk17e-15697662.pdf?src-supplier=Onlinecomponents.com
TP1-TP18 = testPoint_1mm: testPoint 1mm
X1 = CMP-1502-01036-1: SMT Vertical Pin Header WR-PHD, Pitch 2.54 mm, Dual Row, 20 pins; Manufacturer: Wurth Elektronik; Manufacturer Series: 6100; Pin Number: 20; Gender: Male; Rated Current: 3A; Working Voltage: 250VAC; Pitch: 2.54mm; Contact Resistance: 20mOhm; Withstanding Voltage: 500VAC; Connector Type: BOARD CONNECTOR; Option: General Purpose; Filter Feature: No; Body/Shell Style: RECEPTACLE; Number of Rows Loaded: 2; Contact Pattern: RECTANGULAR; Contact Style: SQ PIN-SKT; Number Of Connectors: 1; Dielectric Withstanding Voltage (AC): 500V; Insulation Resistance: 1GR; Mating Contact Pitch: 0.1inch; Body Breadth: 0.2inch; Body Depth: 0.142inch; Body Length: 1inch; Mounting Option 1: LOCKING; PCB Contact Row Spacing: 5.4102mm; Reference Standard: UL; Reliability: COMMERCIAL; Package Reference: 61002021121; Part Number: 61002021121; Datasheet URL: https://katalog.we-online.de/em/datasheet/6100xx21121.pdf; Mounting Technology: SMT; Orientation: Vertical; Row Number: Dual; Publisher: WurthElektronik; Packaging: Tube; Manufacturer URL: http://www.we-online.de; Operating Temperature: -40to125degC; Supplier 1: Digi-Key; Supplier Part Number 1: 732-5468-5-ND; Manufacturer Part Number: 61002021121; RoHS: Yes; Category: Connectors; Stock 1: 578; Pricing 1: 1=3.72000, 10=3.15900, 24=2.63208, 48=2.19292, 96=1.99302, 192=1.81302 (USD); Mount: Board; Contact Material: Copper Alloy; Contact Finish - Mating: GOLD; Contact Finish - Termination: Gold (Au) - with Nickel (Ni) barrier; Insulation Material: Polyamide; Insulation Color: Black; Min Operating Temperature: -40°C; Max Operating Temperature: 125°C; JESD-609 Code: e4; Contact Gender: Male; Mixed Contacts: No; Termination: SMD/SMT; Number of Contacts: 20; Mounting Style: STRAIGHT; Number Of PCB Rows: 2; PCB Contact Pattern: RECTANGULAR; Rated Current (Signal): 3A; Terminal Pitch: 2.54mm; Mating Contact Row Spacing: 0.1inch; Flammability Rating: UL94 V-0; REACH SVHC: Yes; RoHS Compliant: Yes; DIN Conformance: No; IEC Conformance: No; MIL Conformance: No; ComponentLink1URL: https://datasheet.ciiva.com:443/pdfs/VipMasterIC/IC/MIDC/MIDCS04347/MIDCS04347-1.pdf?src-supplier=IHS+Markit; ComponentLink1Description: https://datasheet.ciiva.com:443/pdfs/VipMasterIC/IC/MIDC/MIDCS04347/MIDCS04347-1.pdf?src-supplier=IHS+Markit; ComponentLink2URL: https://katalog.we-online.de/em/datasheet/6100xx21121.pdf?src-supplier=Digi-Key; ComponentLink2Description: https://katalog.we-online.de/em/datasheet/6100xx21121.pdf?src-supplier=Digi-Key; ComponentLink3URL: http://www.farnell.com/cad/1737271.pdf?src-supplier=Element14; ComponentLink3Description: http://www.farnell.com/cad/1737271.pdf?src-supplier=Element14
X2 = CMP-00203-1: Manufacturer: Phoenix Contact; Number of Positions: 12; Number of Levels: 1; Header Orientation: 90°, Right Angle; Current - IEC: 12A; Voltage - IEC: 250V; Current - UL: 8A; Voltage - UL: 300V; Packaging: Bulk; Part Status: Active; Type: Header, Male Pins, Shrouded (4 Side); Positions Per Level: 12; Plug Wire Entry: -; Termination Style: Solder; Mounting Type: Through Hole; Wire Gauge or Range - AWG: -; Wire Gauge or Range - mm²: -; Color: Green; Operating Temperature: -; Contact Mating Finish: Tin; Features: -; Manufacturer Part Number: 1844317; Supplier: Digi-Key; Supplier Part Number: 277-5902-ND; ComponentLink1Description: 1844317.pdf; ComponentLink1URL: http://media.digikey.com/pdf/Data%20Sheets/Phoenix%20Contact%20PDFs/1844317.pdf
X3 X6 = 2059-302/998-403: Barrier Strip Terminal Block, 3A, 0.34mm2, 1 Row(s), 1 Deck(s); Manufacturer: WAGO; Fastening Method: PUSH-IN; Number of Decks: 1; Number of Ways: 2; Voltage Rating: 250V; Wire/Cable Gauge: 22AWG; Safety Approval: UL; Supplier 1: Digi-Key; Manufacturer Part Number: 2059-302/998-403; RoHS: Yes; Category: Connectors; Stock 1: 17368; Pricing 1: 1=1.25000, 10=0.87800, 25=0.81880, 50=0.74320, 100=0.73990, 250=0.62484, 500=0.59194 (USD); Mount: Board; Number of Rows: 1; Current Rating: 3A; Terminal and Terminal Block Type: BARRIER STRIP TERMINAL BLOCK; Wire Cross Section: 0.34mm2; REACH SVHC: Yes; RoHS Compliant: Yes; ComponentLink1URL: https://datasheet.ciiva.com:443/pdfs/VipMasterIC/IC/WAGO/WAGO-S-A0007107760/WAGO-S-A0007107948-1.pdf?src-supplier=IHS+Markit; ComponentLink1Description: https://datasheet.ciiva.com:443/pdfs/VipMasterIC/IC/WAGO/WAGO-S-A0007107760/WAGO-S-A0007107948-1.pdf?src-supplier=IHS+Markit; ComponentLink2URL: https://datasheet.ciiva.com/41441/001208172-da-01-de-smd-leiterplattenklemme-2059-302-998-404-41441808.pdf?src-supplier=Conrad; ComponentLink2Description: https://datasheet.ciiva.com/41441/001208172-da-01-de-smd-leiterplattenklemme-2059-302-998-404-41441808.pdf?src-supplier=Conrad; ComponentLink3URL: https://datasheet.ciiva.com/46435/1860449-46435420.pdf?src-supplier=Element14; ComponentLink3Description: https://datasheet.ciiva.com/46435/1860449-46435420.pdf?src-supplier=Element14; Supplier Part Number 1: 2946-2059-302/998-403CT-ND
X4 X5 X7 X8 = CMP-1676-00003-1: MCRF, PCB Vertical Jack Receptacle, 50 Ohm, 4-Pin SMD, RoHS, Tape and Reel; Manufacturer: Molex; Voltage Rating (AC): 60 V; Mating Cycles: 30; Impedance: 50 Ohm; Frequency: 6 Hz; Gender: Female; Body Material: Polymer,Liquid Crystal Polymer; Body Plating: Gold; Connector Type: Coaxial; Max Frequency: 6GHz; Insulation Resistance: 500MR; Polarity: Standard; RoHSCompliant: true; Length: 3 mm; DatasheetVersion: 04/2016; ComponentLink3URL: http://www.molex.com/pdm_docs/sd/734120110_sd.pdf; Max Operating Temperature: 90 degC; Contact Material: Bronze; Mount: Surface Mount; ComponentLink2Description: Datasheet; Packaging: Tape and Reel; Radiation Hardening: No; Voltage Rating: 60 V; Mounting Technology: Surface Mount; ComponentLink1Description: Manufacturer URL; ComponentLink1URL: http://www.molex.com/; Width: 3 mm; ComponentLink3Description: Package Specification; Package Quantity: 5000; PackageReference: 73412-0110; Min Operating Temperature: -40 degC; Height: 1.25 mm; REACH SVHC: Unknown; ComponentLink2URL: http://www.molex.com/webdocs/datasheets/pdf/en-us/0734120110_RF_COAX_CONNECTORS.pdf; Contact Plating: Gold; PackageDescription: 4-Leads SMD, Body 2.6 x 2.6 mm; PackageVersion: Rev. C14, 07/2015; Supplier 1: Digi-Key; Supplier Part Number 1: WM5587CT-ND; Manufacturer Part Number: 73412-0110; RoHS: Yes; Category: RF / Coaxial Connectors; Stock 1: 111881; Pricing 1: 1=0.70000, 10=0.65600, 25=0.59040, 50=0.52480, 100=0.50300, 250=0.45928, 500=0.43740, 1000=0.36086, 2500=0.32805 (USD); Material: Bronze; Termination: Solder; Orientation: Straight; Halogen Free: Low Halogen; Lead Free: Lead Free; ComponentLink4URL: https://datasheet.ciiva.com/30219/250360734120110-rf-coax-nectors-30219809.pdf?src-supplier=Onlinecomponents.com; ComponentLink4Description: https://datasheet.ciiva.com/30219/250360734120110-rf-coax-nectors-30219809.pdf?src-supplier=Onlinecomponents.com; ComponentLink5URL: https://datasheet.ciiva.com/16653/0734120110-rf-coax-connectors-16653186.pdf?src-supplier=Avnet+Europe; ComponentLink5Description: https://datasheet.ciiva.com/16653/0734120110-rf-coax-connectors-16653186.pdf?src-supplier=Avnet+Europe; ComponentLink6URL: https://datasheet.ciiva.com/11762/0900766b80dfdeb4-11762356.pdf?src-supplier=RSComponents; ComponentLink6Description: https://datasheet.ciiva.com/11762/0900766b80dfdeb4-11762356.pdf?src-supplier=RSComponents; ComponentLink7URL: https://datasheet.ciiva.com/22773/1841262-22773140.pdf?src-supplier=Farnell; ComponentLink7Description: https://datasheet.ciiva.com/22773/1841262-22773140.pdf?src-supplier=Farnell; ComponentLink8URL: https://datasheet.ciiva.com/4600/0734120110-rf-coax-connectors-173239-4600647.pdf?src-supplier=Mouser; ComponentLink8Description: https://datasheet.ciiva.com/4600/0734120110-rf-coax-connectors-173239-4600647.pdf?src-supplier=Mouser; ComponentLink9URL: https://datasheet.ciiva.com/16081/1387750734120110-rf-coax-nectors-16081145.pdf?src-supplier=Onlinecomponents.com; ComponentLink9Description: https://datasheet.ciiva.com/16081/1387750734120110-rf-coax-nectors-16081145.pdf?src-supplier=Onlinecomponents.com; ComponentLink10URL: https://datasheet.ciiva.com/46384/1808577-46384459.pdf?src-supplier=Element14; ComponentLink10Description: https://datasheet.ciiva.com/46384/1808577-46384459.pdf?src-supplier=Element14; ComponentLink11URL: https://datasheet.ciiva.com/9419/0734120110-rf-coax-connectors-9419357.pdf?src-supplier=Avnet; ComponentLink11Description: https://datasheet.ciiva.com/9419/0734120110-rf-coax-connectors-9419357.pdf?src-supplier=Avnet